# Altium schematic sheet Sheet1.SchDoc
size A4
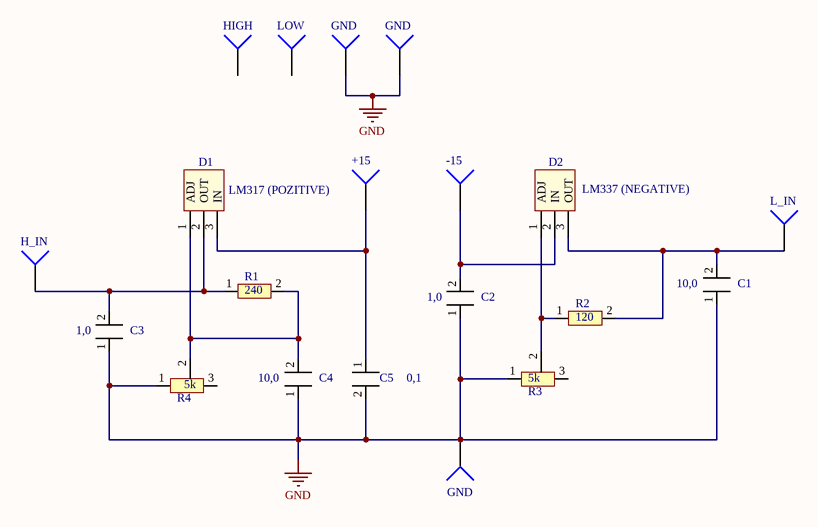
[diagram p0: Sheet1.SchDoc]

## Parts
+15  IN  [PIN1]  (value not drawn)
-15  Socket  [PIN1]  (value not drawn)
C1  10,0  [Cap_BIG]
C2  1,0  [CAP_SMALL]
C3  1,0  [CAP_SMALL]
C4  10,0  [Cap_BIG]
C5  0,1  [CAP_SMALL]
D1  LM317 (POZITIVE)  [TO-220]
D2  LM337 (NEGATIVE)  [TO-220]
H_IN  IN  [PIN1]  (value not drawn)
HIGH  IN  [PIN1]  (value not drawn)
J1  GND  [PIN1]
J2  GND  [PIN1]
J3  GND  [PIN1]
L_IN  IN  [PIN1]  (value not drawn)
LOW  IN  [PIN1]  (value not drawn)
R1  240  [RES]
R2  120  [RES]
R3  5k  [PODSR_RES]
R4  5k  [PODSR_RES]

## Nets
GND: C1.1 C2.1 C3.1 C4.1 C5.2 J1.1 J2.1 J3.1 R3.1 R4.1
Net+15_1: +15.1 C5.1 D1.3(IN)
Net-15_1: -15.1 C2.2 D2.2(IN)
NetC1_2: C1.2 D2.3(OUT) L_IN.1 R2.2
NetC3_2: C3.2 D1.2(OUT) H_IN.1 R1.1
NetC4_2: C4.2 D1.1(ADJ) R1.2 R4.2
NetD2_1: D2.1(ADJ) R2.1 R3.2

Not connected (* = marked no-connect by the designer): HIGH 1; LOW 1; R3 3; R4 3

## Library data of the parts
+15 H_IN HIGH J1-J3 L_IN LOW = Socket: LatestRevisionDate: 17-Jul-2002; LatestRevisionNote: Re-released for DXP Platform.; Publisher: Altium Limited
C1 C4 = CAP_BIG
C2 C3 C5 = CAP_SMALL
R1 R2 = RES
R3 R4 = RES_PODSTR
-15 = Socket: LatestRevisionDate: 17-Jul-2002; LatestRevisionNote: Re-released for DXP Platform.; Publisher: Altium Limited